# EAGLE design Arduino_clone (EAGLE 5.06)
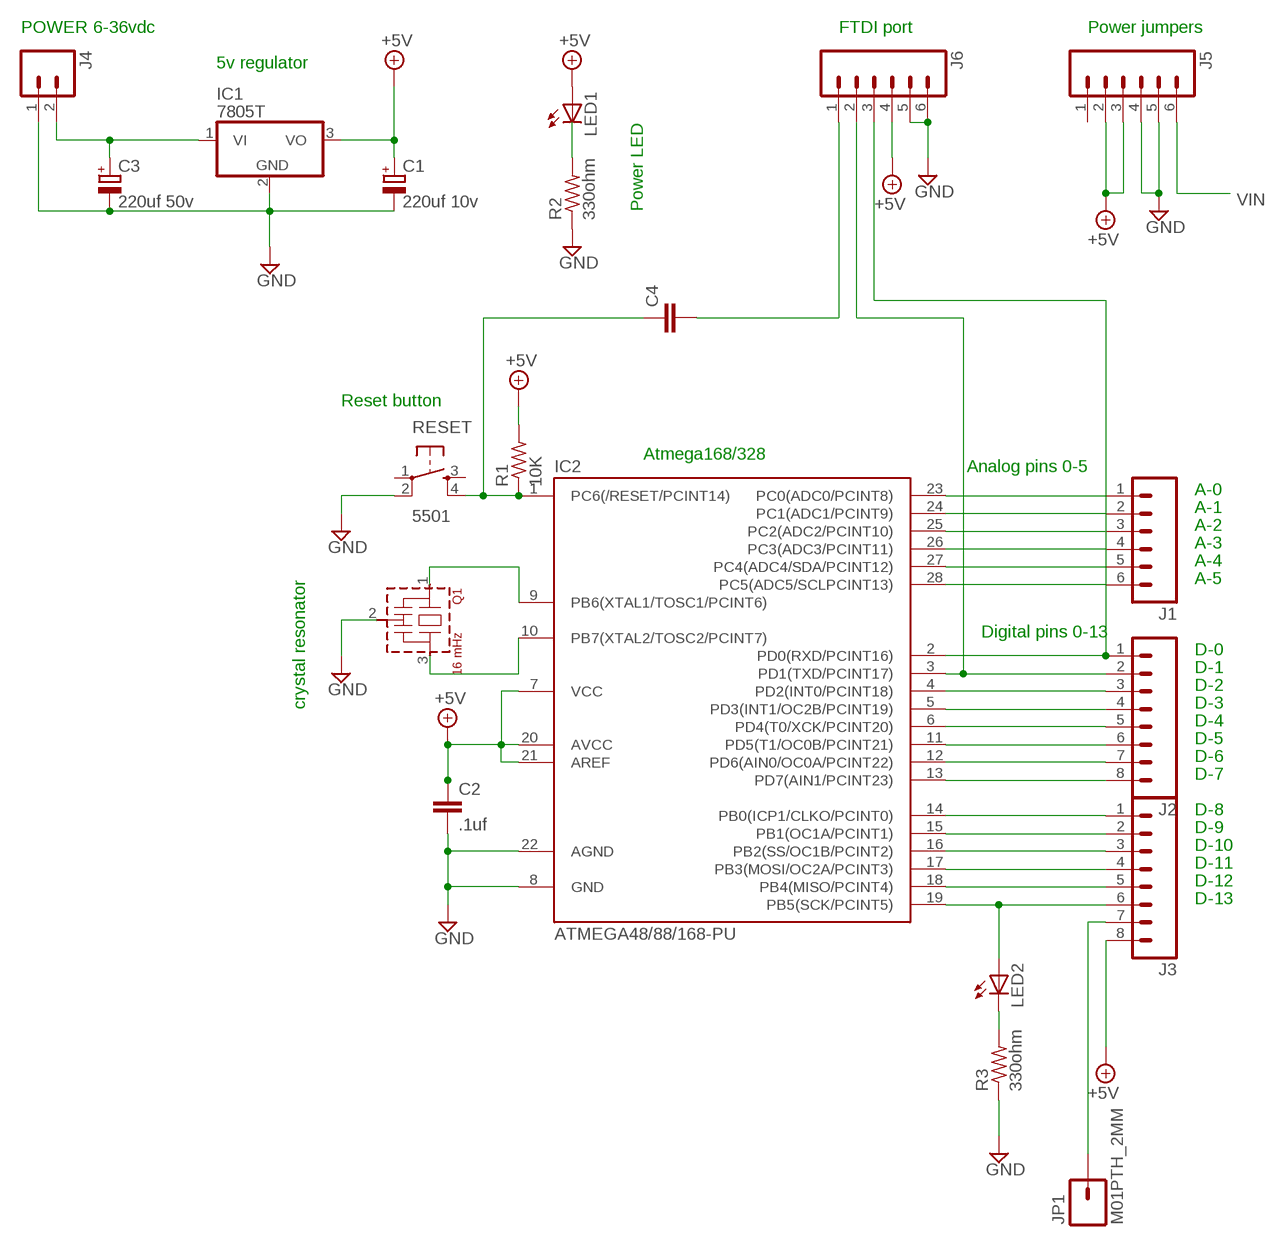
[diagram p0: schematic, sheet 1]

## Parts
C1  220uf 10v  CPOL-EUE2.5-6  [E2,5-6]
C2  .1uf  C-EU050-024X044  [C050-024X044]
C3  220uf 50v  CPOL-EUE2.5-6  [E2,5-6]
C4  C-EU075-032X103  [C075-032X103]
IC1  7805T  [TO220H]
IC2  ATMEGA48/88/168-PU  [DIL28-3]
J1  M06SIP  [1X06]
J2  M08  [1X08]
J3  M08  [1X08]
J4  M02LOCK  [1X02_LOCK]
J5  M06SIP  [1X06]
J6  M06SIP  [1X06]
JP1  M01PTH_2MM  [1X01_2MM]
LED1  LED3MM  [LED3MM]
LED2  LED3MM  [LED3MM]
Q1  16 mHz  CSTLS_X  [CSTLS_X]
R1  10K  R-US_0204/5  [0204/5]
R2  330ohm  R-US_0204/5  [0204/5]
R3  330ohm  R-US_0204/5  [0204/5]
RESET  5501  TAC_SWITCHPTH  [TACTILE-PTH]

## Nets
+5V: C1.+ C2.1 IC1.3(VO) IC2.7(VCC) IC2.20(AVCC) IC2.21(AREF) J3.8 J5.2 J5.3 J6.4 LED1.A R1.2
A0: IC2.23(PC0(ADC0/PCINT8)) J1.1
A1: IC2.24(PC1(ADC1/PCINT9)) J1.2
A2: IC2.25(PC2(ADC2/PCINT10)) J1.3
A3: IC2.26(PC3(ADC3/PCINT11)) J1.4
A4: IC2.27(PC4(ADC4/SDA/PCINT12)) J1.5
A5: IC2.28(PC5(ADC5/SCLPCINT13)) J1.6
D0: IC2.2(PD0(RXD/PCINT16)) J2.1 J6.3
D1: IC2.3(PD1(TXD/PCINT17)) J2.2 J6.2
D2: IC2.4(PD2(INT0/PCINT18)) J2.3
D3: IC2.5(PD3(INT1/OC2B/PCINT19)) J2.4
D4: IC2.6(PD4(T0/XCK/PCINT20)) J2.5
D5: IC2.11(PD5(T1/OC0B/PCINT21)) J2.6
D6: IC2.12(PD6(AIN0/OC0A/PCINT22)) J2.7
D7: IC2.13(PD7(AIN1/PCINT23)) J2.8
D8: IC2.14(PB0(ICP1/CLKO/PCINT0)) J3.1
D9: IC2.15(PB1(OC1A/PCINT1)) J3.2
D10: IC2.16(PB2(SS/OC1B/PCINT2)) J3.3
D11: IC2.17(PB3(MOSI/OC2A/PCINT3)) J3.4
D12: IC2.18(PB4(MISO/PCINT4)) J3.5
D13: IC2.19(PB5(SCK/PCINT5)) J3.6 LED2.A
GND: C1.- C2.2 C3.- IC1.2(GND) IC2.8(GND) IC2.22(AGND) J4.1 J5.4 J5.5 J6.5 J6.6 Q1.2(VSS) R2.1 R3.1 RESET.2
N$1: C4.2 J6.1
N$2: J3.7 JP1.1
N$3: IC2.10(PB7(XTAL2/TOSC2/PCINT7)) Q1.3
N$4: LED2.K(C) R3.2
N$5: IC2.9(PB6(XTAL1/TOSC1/PCINT6)) Q1.1
N$26: LED1.K(C) R2.2
RESET: C4.1 IC2.1(PC6(/RESET/PCINT14)) R1.1 RESET.4
VIN: C3.+ IC1.1(VI) J4.2 J5.6
Unconnected: J5.1 RESET.1 RESET.3

## Notes on the sheet
- POWER 6-36vdc | FTDI port | Power jumpers
- 5v regulator
- Power LED
- Reset button
- Atmega168/328 | Analog pins 0-5
- A-0
- A-1
- A-2
- A-3
- A-4
- A-5
- Digital pins 0-13
- D-0
- D-1
- D-2
- crystal resonator | D-3
- D-4
- D-5
- D-6
- D-7
- D-8
- D-9
- D-10
- D-11
- D-12
- D-13

## Library data of the parts
C1 C3 = rcl:CPOL-EU: POLARIZED CAPACITOR, European symbol
C2 C4 = rcl:C-EU: CAPACITOR, European symbol
IC1 = linear:78*: Positive VOLTAGE REGULATOR Source: http://cache.national.com/ds/LM/LM78L05.pdf http://www.fairchildsemi.com/ds/LM/LM7805.pdf
IC2 = atmega8:ATMEGA48/88/168-PU
J1 J5 J6 = SparkFun:M06: Header 6 Standard 6-pin 0.1" header. Use with straight break away headers (SKU : PRT-00116), right angle break away headers (PRT-00553), swiss pins (PRT-00743), machine pins (PRT-00117), and female headers (PRT-00115). Molex polarized connector foot print use with SKU : PRT-08094 with associated crimp pins and housings. NOTES ON THE VARIANTS LOCK and LOCK_LONGPADS... This footprint was designed to help hold the alignment of a through-hole component (i.e. 6-pin header) while soldering it into place. You may notice that each hole has been shifted either up or down by 0.005 of an inch from it's more standard position (which is a perfectly straight line). This slight alteration caused the pins (the squares in the middle) to touch the edges of the holes. Because they are alternating, it causes a "brace" to hold the component in place. 0.005 has proven to be the perfect amount of "off-center" position when using our standard breakaway headers. Although looks a little odd when you look at the bare footprint, once you have a header in there, the alteration is very hard to notice. Also, if you push a header all the way into place, it is covered up entirely on the bottom side. This idea of altering the position of holes to aid alignment will be further integrated into the Sparkfun Library for other footprints. It can help hold any component with 3 or more connection pins.
J2 J3 = SparkFun:M08: Header 8 Standard 8-pin 0.1" header. Use with straight break away headers (SKU : PRT-00116), right angle break away headers (PRT-00553), swiss pins (PRT-00743), machine pins (PRT-00117), and female headers (PRT-00115).
J4 = SparkFun:M02: Header 2 Standard 2-pin 0.1" header. Use with straight break away headers (SKU : PRT-00116), right angle break away headers (PRT-00553), swiss pins (PRT-00743), machine pins (PRT-00117), and female headers (PRT-00115). Molex polarized connector foot print use with SKU : PRT-08233 with associated crimp pins and housings.
JP1 = SparkFun:M01: Header 1 Standard 1-pin 0.1" header. Use with straight break away headers (SKU : PRT-00116), right angle break away headers (PRT-00553), swiss pins (PRT-00743), machine pins (PRT-00117), and female headers (PRT-00115).
LED1 LED2 = led:LED: LED OSRAM: - CHIPLED LG R971, LG N971, LY N971, LG Q971, LY Q971, LO R971, LY R971 LH N974, LH R974 LS Q976, LO Q976, LY Q976 LO Q996 - Hyper CHIPLED LW Q18S LB Q993, LB Q99A, LB R99A - SideLED LS A670, LO A670, LY A670, LG A670, LP A670 LB A673, LV A673, LT A673, LW A673 LH A674 LY A675 LS A676, LA A676, LO A676, LY A676, LW A676 LS A679, LY A679, LG A679 - Hyper Micro SIDELED® LS Y876, LA Y876, LO Y876, LY Y876 LT Y87S - SmartLED LW L88C, LW L88S LB L89C, LB L89S, LG L890 LS L89K, LO L89K, LY L89K LS L896, LA L896, LO L896, LY L896 - TOPLED LS T670, LO T670, LY T670, LG T670, LP T670 LSG T670, LSP T670, LSY T670, LOP T670, LYG T670 LG T671, LOG T671, LSG T671 LB T673, LV T673, LT T673, LW T673 LH T674 LS T676, LA T676, LO T676, LY T676, LB T676, LH T676, LSB T676, LW T676 LB T67C, LV T67C, LT T67C, LS T67K, LO T67K, LY T67K, LW E67C LS E67B, LA E67B, LO E67B, LY E67B, LB E67C, LV E67C, LT E67C LW T67C LS T679, LY T679, LG T679 LS T770, LO T770, LY T770, LG T770, LP T770 LB T773, LV T773, LT T773, LW T773 LH T774 LS E675, LA E675, LY E675, LS T675 LS T776, LA T776, LO T776, LY T776, LB T776 LHGB T686 LT T68C, LB T68C - Hyper Mini TOPLED® LB M676 - Mini TOPLED Santana® LG M470 LS M47K, LO M47K, LY M47K Source: http://www.osram.convergy.de LUXEON: - LUMILED® LXK2-PW12-R00, LXK2-PW12-S00, LXK2-PW14-U00, LXK2-PW14-V00 LXK2-PM12-R00, LXK2-PM12-S00, LXK2-PM14-U00 LXK2-PE12-Q00, LXK2-PE12-R00, LXK2-PE12-S00, LXK2-PE14-T00, LXK2-PE14-U00 LXK2-PB12-K00, LXK2-PB12-L00, LXK2-PB12-M00, LXK2-PB14-N00, LXK2-PB14-P00, LXK2-PB14-Q00 LXK2-PR12-L00, LXK2-PR12-M00, LXK2-PR14-Q00, LXK2-PR14-R00 LXK2-PD12-Q00, LXK2-PD12-R00, LXK2-PD12-S00 LXK2-PH12-R00, LXK2-PH12-S00 LXK2-PL12-P00, LXK2-PL12-Q00, LXK2-PL12-R00 Source: www.luxeon.com KINGBRIGHT: KA-3528ASYC Source: www.kingbright.com
Q1 = murata-resonators:CSTLS_X: Ceramic resonator 16.00 to 70.00 MHz
R1-R3 = rcl:R-US_: RESISTOR, American symbol
RESET = SparkFun:TAC_SWITCH: Momentary Switch Button commonly used for reset or general input. Spark Fun Electronics SKU : COM-00097

## Board
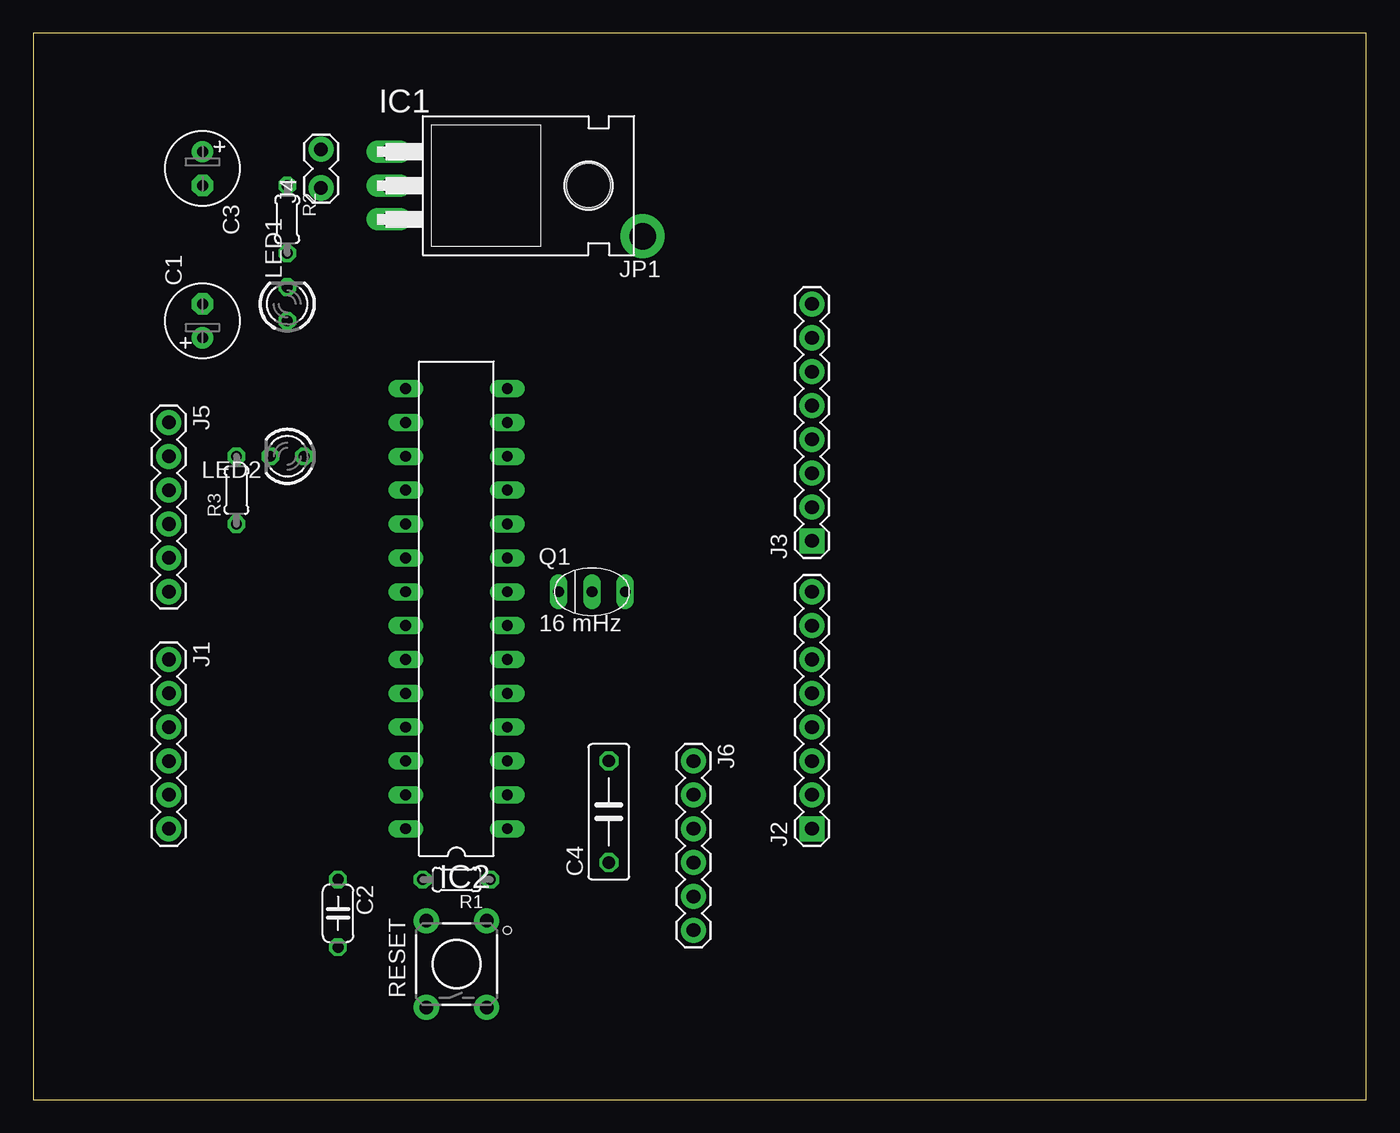
[diagram p1: board, top side]
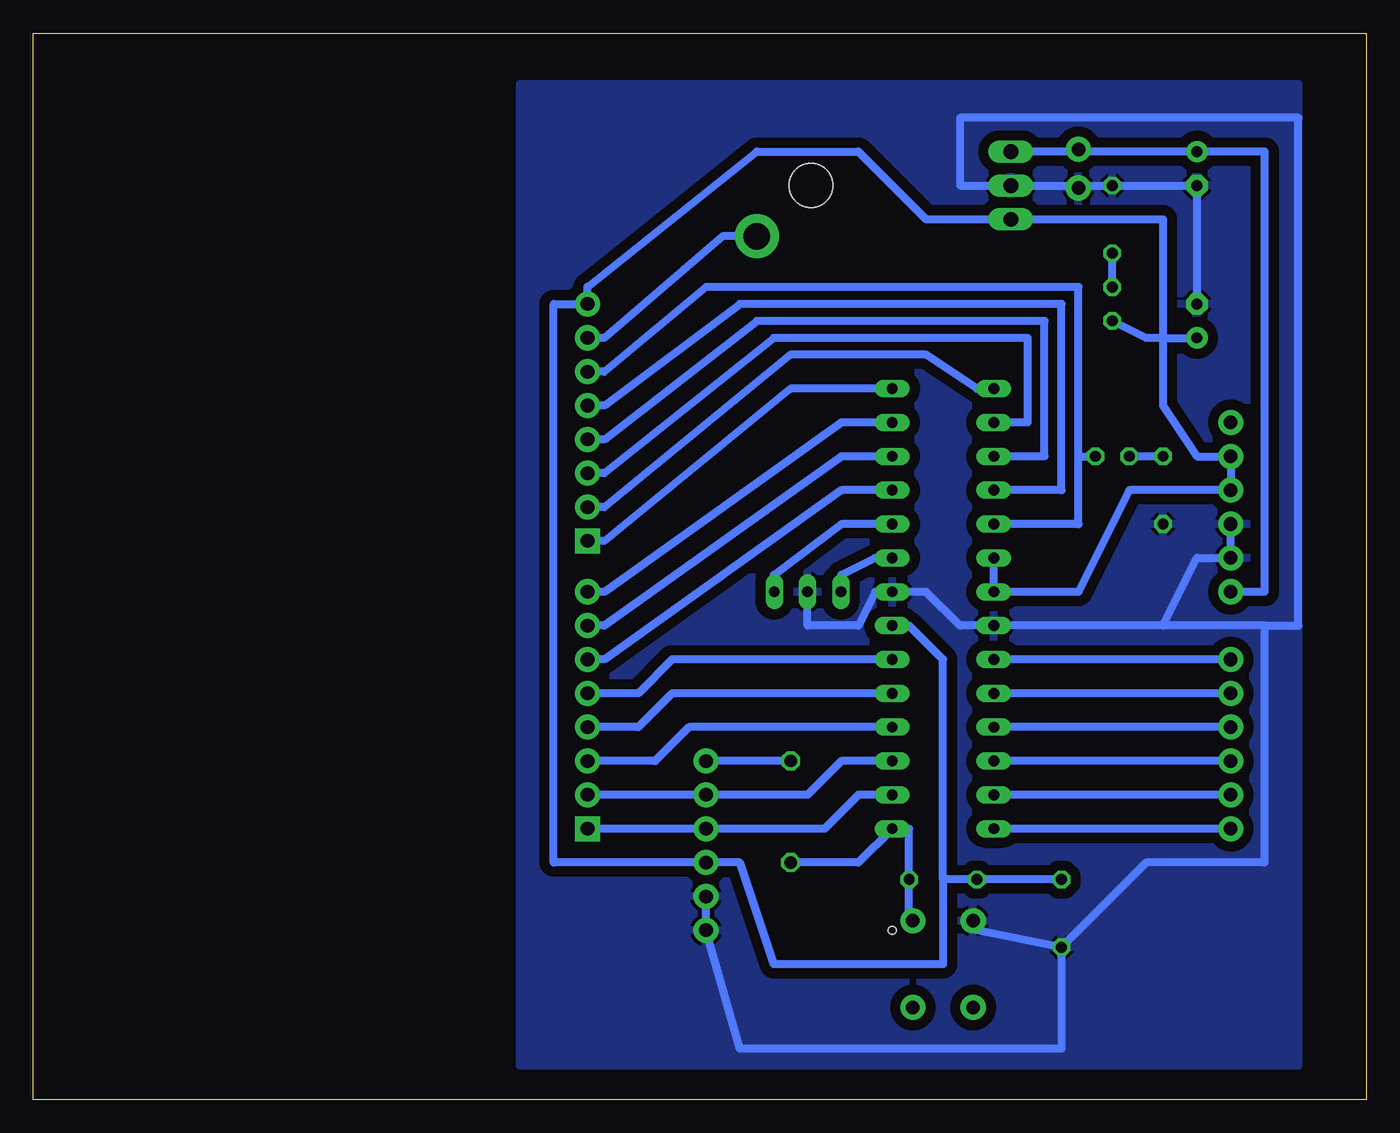
[diagram p2: board, bottom side, seen from below]

Size 100 x 80 mm. Coordinates in mm from the lower left corner, seen from the top.
Outline: 0,0 100,0 100,80 0,80 0,0
Copper layers (1*16): Top 0.035mm / dielectric 1.5mm / Bottom 0.035mm
Design rules "default *": minimum track width 10mil, minimum drill 24mil, track to track 30mil, track to pad 30mil, pad to pad 8mil, via to via 8mil, smd to smd 8mil, copper to edge 40mil, drill to drill 8mil, minimum pad ring 10mil, minimum via ring 8mil, stop-mask expansion 4mil, vias tented up to drill 0mil, thermal gap 10mil
Holes 0.6 mm at 35.56,12.7

### Footprints (pad centres in the part's own frame; a part is rotated, then mirrored left to right if it is on the bottom)
E2,5-6 = drill 0.813 pad 1.6 round: + -1.27,0 | drill 0.813 pad 1.6 octagon: - 1.27,0
C050-024X044 = drill 0.813 octagon: 1 -2.54,0; 2 2.54,0
C075-032X103 = drill 0.914 octagon: 1 -3.81,0; 2 3.81,0
TO220H = drill 1.118 long: 1 -2.54,-10.16; 2 0,-10.16; 3 2.54,-10.16 | hole 3.302: 0,4.826
DIL28-3 = drill 0.813 long: 1 -16.51,-3.81; 2 -13.97,-3.81; 3 -11.43,-3.81; 4 -8.89,-3.81; 5 -6.35,-3.81; 6 -3.81,-3.81; 7 -1.27,-3.81; 8 1.27,-3.81; 9 3.81,-3.81; 10 6.35,-3.81; 11 8.89,-3.81; 12 11.43,-3.81; 13 13.97,-3.81; 14 16.51,-3.81; 15 16.51,3.81; 16 13.97,3.81; 17 11.43,3.81; 18 8.89,3.81; 19 6.35,3.81; 20 3.81,3.81; 21 1.27,3.81; 22 -1.27,3.81; 23 -3.81,3.81; 24 -6.35,3.81; 25 -8.89,3.81; 26 -11.43,3.81; 27 -13.97,3.81; 28 -16.51,3.81
1X06 = drill 1.016 pad 1.88 round: 1 0,0; 2 2.54,0; 3 5.08,0; 4 7.62,0; 5 10.16,0; 6 12.7,0
1X08 = drill 1.016 pad 1.88 square: 1 0,0 | drill 1.016 pad 1.88 round: 2 2.54,0; 3 5.08,0; 4 7.62,0; 5 10.16,0; 6 12.7,0; 7 15.24,0; 8 17.78,0
1X02_LOCK = drill 1.016 pad 1.88 round: 1 -0.178,0; 2 2.718,0
1X01_2MM = drill 2 pad 3.302 round: 1 0,0
LED3MM = drill 0.813 octagon: A -1.27,0; K 1.27,0
CSTLS_X = drill 0.813 long: 1 -2.5,0; 2 0,0; 3 2.5,0
0204/5 = drill 0.813 octagon: 1 -2.54,0; 2 2.54,0
TACTILE-PTH = drill 1.016 pad 1.88 round: 1 -3.251,2.261; 2 3.251,2.261; 3 -3.251,-2.261; 4 3.251,-2.261

### Placement (x,y rotation side)
C1  12.7,58.42 90 top
C2  22.86,13.97 270 top
C3  12.7,69.85 270 top
C4  43.18,21.59 90 top
IC1  36.83,68.58 270 top
IC2  31.75,36.83 90 top
J1  10.16,33.02 270 top
J2  58.42,20.32 90 top
J3  58.42,41.91 90 top
J4  21.59,68.58 90 top
J5  10.16,50.8 270 top
J6  49.53,25.4 270 top
JP1  45.72,64.77 180 top
LED1  19.05,59.69 90 top
LED2  19.05,48.26 180 top
Q1  41.91,38.1 0 top
R1  31.75,16.51 180 top
R2  19.05,66.04 270 top
R3  15.24,45.72 90 top
RESET  31.75,10.16 90 top

### Tracks (layer width: path | path; a pad name or v marks a point on that pad's centre or on a via)
+5V
  Bottom 0.61: 15.24,57.15 15.24,66.04 IC1.3 33.02,66.04 38.1,71.12 45.72,71.12 58.42,60.96 J3.8 60.96,59.69 60.96,17.78 J6.4 46.99,17.78 44.45,10.16 31.75,10.16 31.75,16.51 | 15.24,57.15 C1.+ | 15.24,57.15 15.24,52.07 12.7,48.26 J5.2 J5.3 17.78,45.72 21.59,38.1 IC2.21 IC2.20 | 15.24,57.15 16.51,57.15 LED1.A | IC2.7 34.29,35.56 31.75,33.02 31.75,16.51 | 31.75,16.51 R1.2 C2.1
A0
  Bottom 0.61: J1.1 IC2.23
A1
  Bottom 0.61: J1.2 IC2.24
A2
  Bottom 0.61: J1.3 IC2.25
A3
  Bottom 0.61: J1.4 IC2.26
A4
  Bottom 0.61: J1.5 IC2.27
A5
  Bottom 0.61: J1.6 IC2.28
D0
  Bottom 0.61: IC2.2 38.1,22.86 40.64,20.32 J6.3 J2.1
D1
  Bottom 0.61: IC2.3 39.37,25.4 41.91,22.86 J6.2 J2.2
D2
  Bottom 0.61: J2.3 53.34,25.4 50.8,27.94 IC2.4
D3
  Bottom 0.61: J2.4 54.61,27.94 52.07,30.48 IC2.5
D4
  Bottom 0.61: J2.5 54.61,30.48 52.07,33.02 IC2.6
D5
  Bottom 0.61: IC2.11 39.37,45.72 57.15,33.02 J2.6
D6
  Bottom 0.61: IC2.12 39.37,48.26 57.15,35.56 J2.7
D7
  Bottom 0.61: IC2.13 39.37,50.8 57.15,38.1 J2.8
D8
  Bottom 0.61: IC2.14 43.18,53.34 57.15,41.91 J3.1
D9
  Bottom 0.61: IC2.15 29.21,53.34 33.02,55.88 43.18,55.88 57.15,44.45 J3.2
D10
  Bottom 0.61: IC2.16 25.4,50.8 25.4,57.15 44.45,57.15 57.15,46.99 J3.3
D11
  Bottom 0.61: IC2.17 24.13,48.26 24.13,58.42 45.72,58.42 57.15,49.53 J3.4
D12
  Bottom 0.61: IC2.18 22.86,45.72 22.86,59.69 46.99,59.69 57.15,52.07 J3.5
D13
  Bottom 0.61: IC2.19 21.59,43.18 21.59,48.26 | 21.59,48.26 21.59,60.96 49.53,60.96 57.15,54.61 J3.6 | 21.59,48.26 LED2.A
GND
  Bottom 0.61: J6.5 J6.6 46.99,3.81 22.86,3.81 C2.2 | C2.2 29.21,12.7 RESET.2 | Q1.2 41.91,35.56 38.1,35.56 36.83,38.1 IC2.8 33.02,38.1 30.48,35.56 IC2.22 15.24,35.56 | J5.4 J5.5 12.7,40.64 15.24,35.56 | 21.59,68.58 C3.- C1.- | 21.59,68.58 IC1.2 30.48,68.58 30.48,73.66 5.08,73.66 5.08,35.56 7.62,35.56 | 21.59,68.58 J4.1 | C2.2 16.51,17.78 7.62,17.78 7.62,35.56 | 7.62,35.56 15.24,35.56
  pour Bottom: 63.5,2.54 63.5,76.2 5.08,76.2 5.08,2.54
N$1
  Bottom 0.61: C4.2 J6.1
N$2
  Bottom 0.61: J3.7 57.15,57.15 48.26,64.77 JP1.1
N$3
  Bottom 0.61: IC2.10 39.37,43.18 44.45,39.37 44.45,38.1 Q1.3
N$4
  Bottom 0.61: R3.2 LED2.K
N$5
  Bottom 0.61: IC2.9 36.83,40.64 39.37,39.37 39.37,38.1 Q1.1
N$26
  Bottom 0.61: LED1.K R2.2
RESET
  Bottom 0.61: C4.1 38.1,17.78 IC2.1 34.29,20.32 R1.1 34.29,13.97 RESET.4
VIN
  Bottom 0.61: 21.59,71.12 C3.+ 7.62,71.12 7.62,38.1 J5.6 | 21.59,71.12 IC1.1 | 21.59,71.12 J4.2